# Altium schematic sheet Power.SchDoc
size A4; SheetNumber: 4; SheetTotal: 4
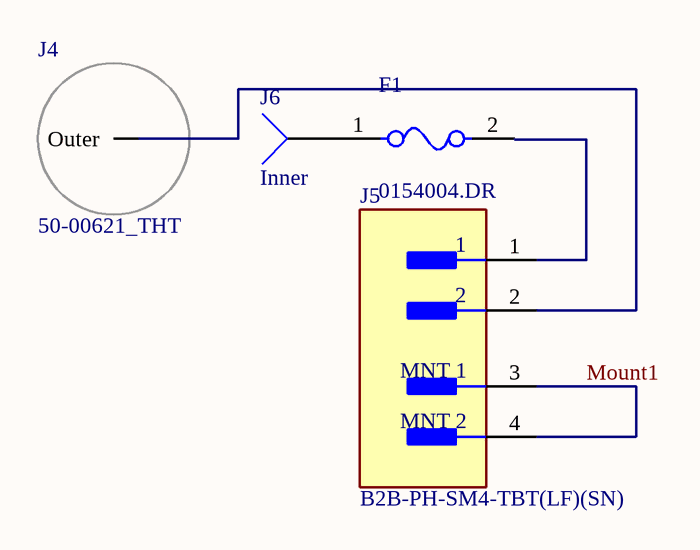
[diagram p0: Power.SchDoc]

## Parts
F1  0154004.DR  [FP-0154-MFG]
J4  50-00621_THT  [50-00621_THT]
J5  B2B-PH-SM4-TBT(LF)(SN)  [FP-B2B-PH-SM4-TBT_LF_SN-MFG]
J6  Inner  [PIN1]  (no BOM)

## Nets
Mount1: J5.3(MNT_1) J5.4(MNT_2)
NetF1_1: F1.1 J6.1
NetF1_2: F1.2 J5.1
NetJ4_1: J4.1(Outer) J5.2

## Library data of the parts
F1 = CMP-08605-000003-1: FUSE BRD MNT 4A 125VAC/VDC 2SMD; Manufacturer: Littelfuse; Fuse Blow Speed: Fast; Max Fuse Ac Voltage: 125V; Lead Free: Yes; Device Class L3: unset; Manufacturer Part Number: 0154004.DR; Device Class L2: Fuses; Package: 0154; ComponentLink2Description: Datasheet; Temperature Range Low: -55°C; Temperature Range High: +125°C; Device Class L1: Circuit Protection; Height: 3.81mm; Temperature: -55°C to +125°C; Mouser Description: Surface Mount Fuses Fuseblock w/ fuse 4A OMNI BLOK 154; Automotive: No; Digikey Description: FUSE BRD MNT 4A 125VAC/VDC 2SMD; RoHS: TRUE; Category: Fuse; Fuse Current: 4A; Max Fuse Dc Voltage: 125V; ComponentLink2URL: https://www.littelfuse.com/~/media/electronics/datasheets/fuses/littelfuse_fuse_154_154t_154l_154tl_datasheet.pdf.pdf; Octopart: https://octopart.com/0154004.dr-littelfuse-565861; JLCPCBPartNum: C206914
J4 = 50-00621: Tensility Connector, dc plug, 4.0x1.7x21.3 mm, dual solder tabs, spring contacts, nickel plated, 105 °C
J5 = CMP-17439-000005-1: CONN HEADER SMD 2POS 2MM; Manufacturer: JST; Current Rating: 2A; Conn Gender: Male; Voltage Rating: 100V; Conn Orientation: Vertical; Number Of Contacts: 2; Octopart: https://octopart.com/b2b-ph-sm4-tbt%28lf%29%28sn%29-jst-7877930; Number Of Rows: 1; Device Class L2: Headers and Wire Housings; RoHS: TRUE; Contact Material: Tin,Copper; Height: 6.65mm; Temperature: -25°C to +85°C; Temperature Range Low: -25°C; ComponentLink2Description: Datasheet; Manufacturer Part Number: B2B-PH-SM4-TBT(LF)(SN); ComponentLink2URL: http://www.jst-mfg.com/product/pdf/eng/ePH.pdf; Automotive: No; Pitch: 2mm; Lead Free: Yes; Device Class L3: unset; Category: Conn; Digikey Description: CONN HEADER SMD 2POS 2MM; Temperature Range High: +85°C; Package: 0; Device Class L1: Connectors; JLCPCBPartNum: C265003
J6 = Socket: LatestRevisionDate: 17-Jul-2002; LatestRevisionNote: Re-released for DXP Platform.; Publisher: Altium Limited